# Altium schematic sheet 01-Amplifier.SchDoc: Amplifier TAS5751M
size A3; SheetNumber: 2; SheetTotal: 6
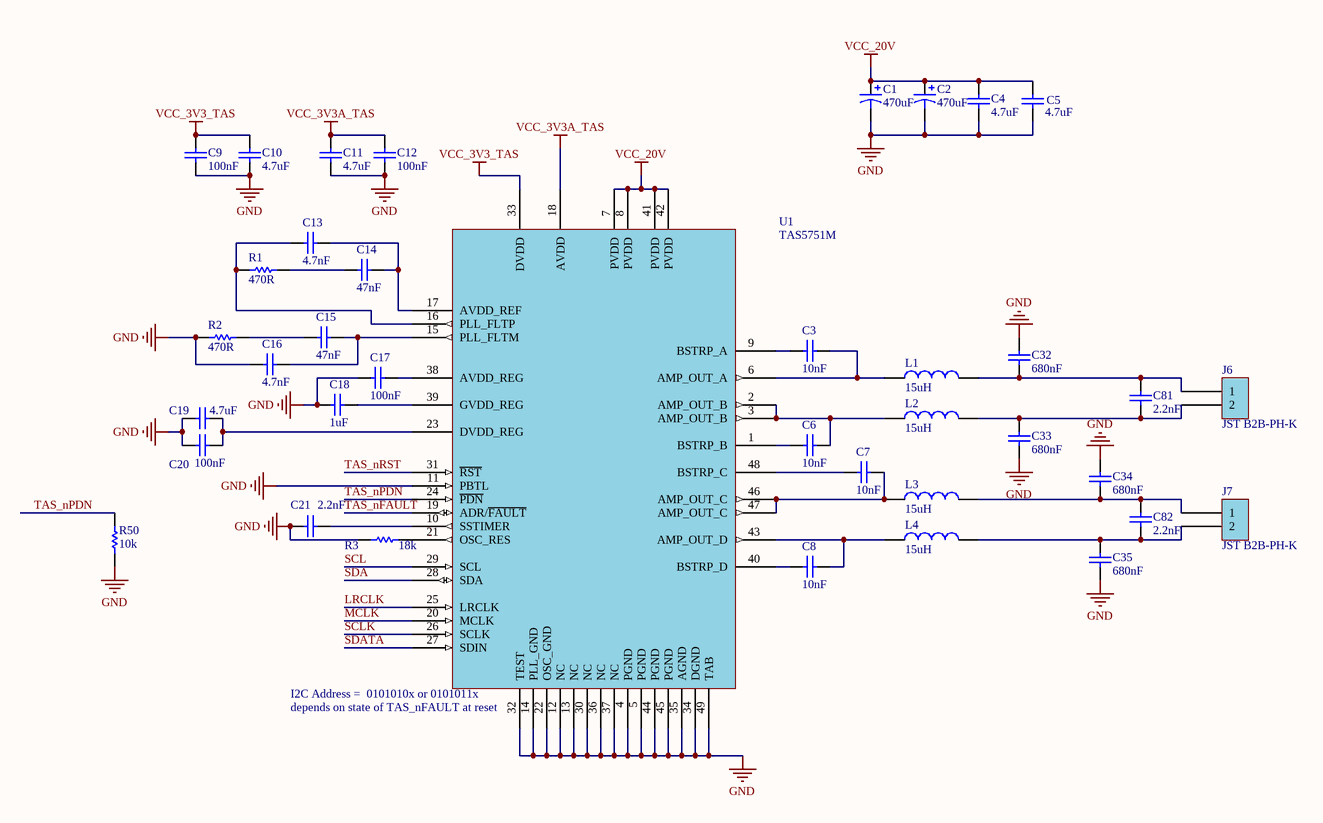
[diagram p0: 01-Amplifier.SchDoc]

## Parts
C1  value 470uF  [Cap_POL_10mm_12.5mm_TH]  (hidden comment: 470uF 25V)
C2  value 470uF  [Cap_POL_10mm_12.5mm_TH]  (hidden comment: 470uF 25V)
C3  value 10nF  [CAPC3216X16N]  (hidden comment: 10nF 50V 1206 X7R)
C4  value 4.7uF  [CAPC3216X16N]  (hidden comment: 4.7uF 50V 1206 X5R)
C5  value 4.7uF  [CAPC3216X16N]  (hidden comment: 4.7uF 50V 1206 X5R)
C6  value 10nF  [CAPC3216X16N]  (hidden comment: 10nF 50V 1206 X7R)
C7  value 10nF  [CAPC3216X16N]  (hidden comment: 10nF 50V 1206 X7R)
C8  value 10nF  [CAPC3216X16N]  (hidden comment: 10nF 50V 1206 X7R)
C9  value 100nF  [CAPC1608X06N]  (hidden comment: 100nF 25V 0603 X5R)
C10  value 4.7uF  [CAPC1608X06N]  (hidden comment: 4.7uF 10V 0603 X5R)
C11  value 4.7uF  [CAPC1608X06N]  (hidden comment: 4.7uF 10V 0603 X5R)
C12  value 100nF  [CAPC1608X06N]  (hidden comment: 100nF 25V 0603 X5R)
C13  value 4.7nF  [CAPC1608X06N]  (hidden comment: 4.7nF 50V 0603 X7R)
C14  value 47nF  [CAPC1608X06N]  (hidden comment: 47nF 50V 0603 X7R)
C15  value 47nF  [CAPC1608X06N]  (hidden comment: 47nF 50V 0603 X7R)
C16  value 4.7nF  [CAPC1608X06N]  (hidden comment: 4.7nF 50V 0603 X7R)
C17  value 100nF  [CAPC1608X06N]  (hidden comment: 100nF 25V 0603 X5R)
C18  value 1uF  [CAPC1608X06N]  (hidden comment: 1uF 16V 0603 X7R)
C19  value 4.7uF  [CAPC1608X06N]  (hidden comment: 4.7uF 10V 0603 X5R)
C20  value 100nF  [CAPC1608X06N]  (hidden comment: 100nF 25V 0603 X5R)
C21  value 2.2nF  [CAPC1608X06N]  (hidden comment: 2.2nF 50V 0603 X7R)
C32  value 680nF  [CAPC3216X16N]  (hidden comment: 680nF 50V 1206 C0G)
C33  value 680nF  [CAPC3216X16N]  (hidden comment: 680nF 50V 1206 C0G)
C34  value 680nF  [CAPC3216X16N]  (hidden comment: 680nF 50V 1206 C0G)
C35  value 680nF  [CAPC3216X16N]  (hidden comment: 680nF 50V 1206 C0G)
C81  value 2.2nF  [CAPC1608X06N]  (hidden comment: 2.2nF 50V 0603 X7R)
C82  value 2.2nF  [CAPC1608X06N]  (hidden comment: 2.2nF 50V 0603 X7R)
J6  JST B2B-PH-K  [JST B2B-PH-K]
J7  JST B2B-PH-K  [JST B2B-PH-K]
L1  value 15uH  [1255AY]  (hidden comment: 1255AY-150M)
L2  value 15uH  [1255AY]  (hidden comment: 1255AY-150M)
L3  value 15uH  [1255AY]  (hidden comment: 1255AY-150M)
L4  value 15uH  [1255AY]  (hidden comment: 1255AY-150M)
R1  value 470R  [RESC1608X06N]  (hidden comment: 470R_0603)
R2  value 470R  [RESC1608X06N]  (hidden comment: 470R_0603)
R3  value 18k  [RESC1608X06N]  (hidden comment: 18k_0603)
R50  value 10k  [RESC1608X06N]  (hidden comment: 10k_0603)
U1  TAS5751M  [TSSOP50P810X120_HS-49M]

## Nets
GND: C1.2 C2.2 C4.1 C5.1 C9.1 C10.1 C11.1 C12.1 C16.1 C17.2 C18.1 C19.2 C20.2 C21.1 C32.1 C33.1 C34.1 C35.1 R2.1 R3.1 R50.2 U1.4(PGND) U1.5(PGND) U1.11(PBTL) U1.12(NC) U1.13(NC) U1.14(PLL_GND) U1.22(OSC_GND) U1.30(NC) U1.32(TEST) U1.34(DGND) U1.35(AGND) U1.36(NC) U1.37(NC) U1.44(PGND) U1.45(PGND) U1.49(TAB)
VCC_3V3_TAS: C9.2 C10.2 U1.33(DVDD)
VCC_3V3A_TAS: C11.2 C12.2 U1.18(AVDD)
VCC_20V: C1.1 C2.1 C4.2 C5.2 U1.7(PVDD) U1.8(PVDD) U1.41(PVDD) U1.42(PVDD)
LRCLK: U1.25(LRCLK)
MCLK: U1.20(MCLK)
SCL: U1.29(SCL)
SCLK: U1.26(SCLK)
SDA: U1.28(SDA)
SDATA: U1.27(SDIN)
TAS_nFAULT: U1.19(ADR/~{FAULT})
TAS_nPDN: R50.1 U1.24(~{PDN})
TAS_nRST: U1.31(~{RST})
NetC3_1: C3.1 U1.9(BSTRP_A)
NetC3_2: C3.2 L1.1 U1.6(AMP_OUT_A)
NetC6_1: C6.1 U1.1(BSTRP_B)
NetC6_2: C6.2 L2.1 U1.2(AMP_OUT_B) U1.3(AMP_OUT_B)
NetC7_1: C7.1 U1.48(BSTRP_C)
NetC7_2: C7.2 L3.1 U1.46(AMP_OUT_C) U1.47(AMP_OUT_C)
NetC8_1: C8.1 U1.40(BSTRP_D)
NetC8_2: C8.2 L4.1 U1.43(AMP_OUT_D)
NetC13_1: C13.1 R1.1 U1.16(PLL_FLTP)
NetC13_2: C13.2 C14.2 U1.17(AVDD_REF)
NetC14_1: C14.1 R1.2
NetC15_1: C15.1 R2.2
NetC15_2: C15.2 C16.2 U1.15(PLL_FLTM)
NetC17_1: C17.1 U1.38(AVDD_REG)
NetC18_2: C18.2 U1.39(GVDD_REG)
NetC19_1: C19.1 C20.1 U1.23(DVDD_REG)
NetC21_2: C21.2 U1.10(SSTIMER)
NetC32_2: C32.2 C81.2 J6.1 L1.2
NetC33_2: C33.2 C81.1 J6.2 L2.2
NetC34_2: C34.2 C82.2 J7.1 L3.2
NetC35_2: C35.2 C82.1 J7.2 L4.2
NetR3_2: R3.2 U1.21(OSC_RES)

## Notes on the sheet
- (near U1) I2C Address =  0101010x or 0101011x
- (near U1) depends on state of TAS_nFAULT at reset
- Title
- Size:
- Date:
- A3
- Number:
- Author:
- Revision:
- Sheet
- of
- File:

## Library data of the parts
C1 C2 = 470uF 25V 10mm 12.5mm: Aluminum Capacitor 470uF 25V TH 10mm 12.5mm; PartNumber: EKZN250ELL471MJC5S; Manufacturer: United Chemi-Con; Tolerance: 20%; Voltage: 25V; Supplier1: Mouser; RefSupplier1: 661-EKZN250E471MJC5S
C3 C6-C8 = 10nF 50V 1206 X7R: Tolerance: 10%; Voltage: 50V; Supplier1: Digikey; Supplier2: Mouser; Supplier3: Farnell; RefSupplier1: 478-1542-1-ND; RefSupplier2: *; RefSupplier3: *; Case: 1206; Material: X7R
C4 C5 = 4.7uF 50V 1206 X5R: Tolerance: 10%; Voltage: 50V; Supplier1: Digikey; Supplier2: Mouser; Supplier3: Farnell; RefSupplier1: 587-2994-1-ND; RefSupplier2: *; RefSupplier3: *; Case: 1206; Material: X5R
C9 C12 C17 C20 = 100nF 25V 0603 X5R: Tolerance: 10%; Voltage: 25V; Supplier1: Digikey; Supplier2: Mouser; Supplier3: Farnell; RefSupplier1: 587-1245-1-ND; RefSupplier2: *; RefSupplier3: *; Case: 0603; Material: X5R
C10 C11 C19 = 4.7uF 10V 0603 X5R: Tolerance: 10%; Voltage: 10V; Supplier1: Digikey; Supplier2: Mouser; Supplier3: Farnell; RefSupplier1: 1276-6684-1-ND; RefSupplier2: *; RefSupplier3: *; Case: 0603; Material: X5R
C13 C16 = 4.7nF 50V 0603 X7R: Tolerance: 10%; Voltage: 50V; Supplier1: Digikey; Supplier2: Mouser; Supplier3: Farnell; RefSupplier1: 490-12741-1-ND; RefSupplier2: *; RefSupplier3: *; Case: 0603; Material: X7R
C14 C15 = 47nF 50V 0603 X7R: Tolerance: 10%; Voltage: 50V; Supplier1: Digikey; Supplier2: Mouser; Supplier3: Farnell; RefSupplier1: 1276-1063-1-ND; RefSupplier2: *; RefSupplier3: *; Case: 0603; Material: X7R
C18 = 1uF 16V 0603 X7R: Tolerance: 10%; Voltage: 16V; Supplier1: Digikey; Supplier2: Mouser; Supplier3: Farnell; RefSupplier1: EMK107B7105KA-T; RefSupplier2: *; RefSupplier3: *; Case: 0603; Material: X7R
C21 C81 C82 = 2.2nF 50V 0603 X7R: Tolerance: 10%; Voltage: 50V; Supplier1: Digikey; Supplier2: Mouser; Supplier3: Farnell; RefSupplier1: 1276-6530-1-ND; RefSupplier2: *; RefSupplier3: *; Case: 0603; Material: X7R
C32-C35 = 680nF 50V 1206 C0G: Tolerance: 10%; Voltage: 50V; Supplier1: Digikey; Supplier2: Mouser; Supplier3: Farnell; RefSupplier1: 1276-2849-1-ND; RefSupplier2: *; RefSupplier3: *; Case: 1206; Material: C0G
L1-L4 = 1255AY-150M: Manufacturer: Murata; Rated Current: 2.4A; PartNumber: 1255AY-150M; Case: 2424; Supplier1: Digikey; Supplier2: Mouser; Supplier3: Farnell; RefSupplier2: *; RefSupplier3: *
R1 R2 = 470R: Resistor 470R 0603 1%; Case: 0603; Tolerance: 1%; Size: 0603, 1.6x0.8x0.8mm; Supplier1: Digikey; Supplier2: *; Supplier3: *; RefSupplier1: 311-470HRCT-ND; RefSupplier2: *; RefSupplier3: *
R3 = 18k: Resistor 18k 0603 1%; Case: 0603; Tolerance: 1%; Size: 0603, 1.6x0.8x0.8mm; RefSupplier1: 311-18.0KHRCT-ND; RefSupplier2: *; RefSupplier3: *; Supplier1: Digikey; Supplier2: *; Supplier3: *
R50 = 10k: Resistor 10k 0603 1%; Case: 0603; Tolerance: 1%; Size: 0603, 1.6x0.8x0.8mm; RefSupplier1: 311-10.0KHRCT-ND; RefSupplier2: *; RefSupplier3: *; Supplier1: Digikey; Supplier2: *; Supplier3: *
U1 = TAS5751M: TAS5751M - Digital Input Audio Power Amplifier with EQ and 3-Band AGL; Manufacturer: TI; PartNumber: TAS5751M; Case: TSSOP48
J6 J7 = JST B2B-PH-K: PartNumber: B2B-PH-K; Manufacturer: JST